# Altium project SensorBoard.PrjPcb
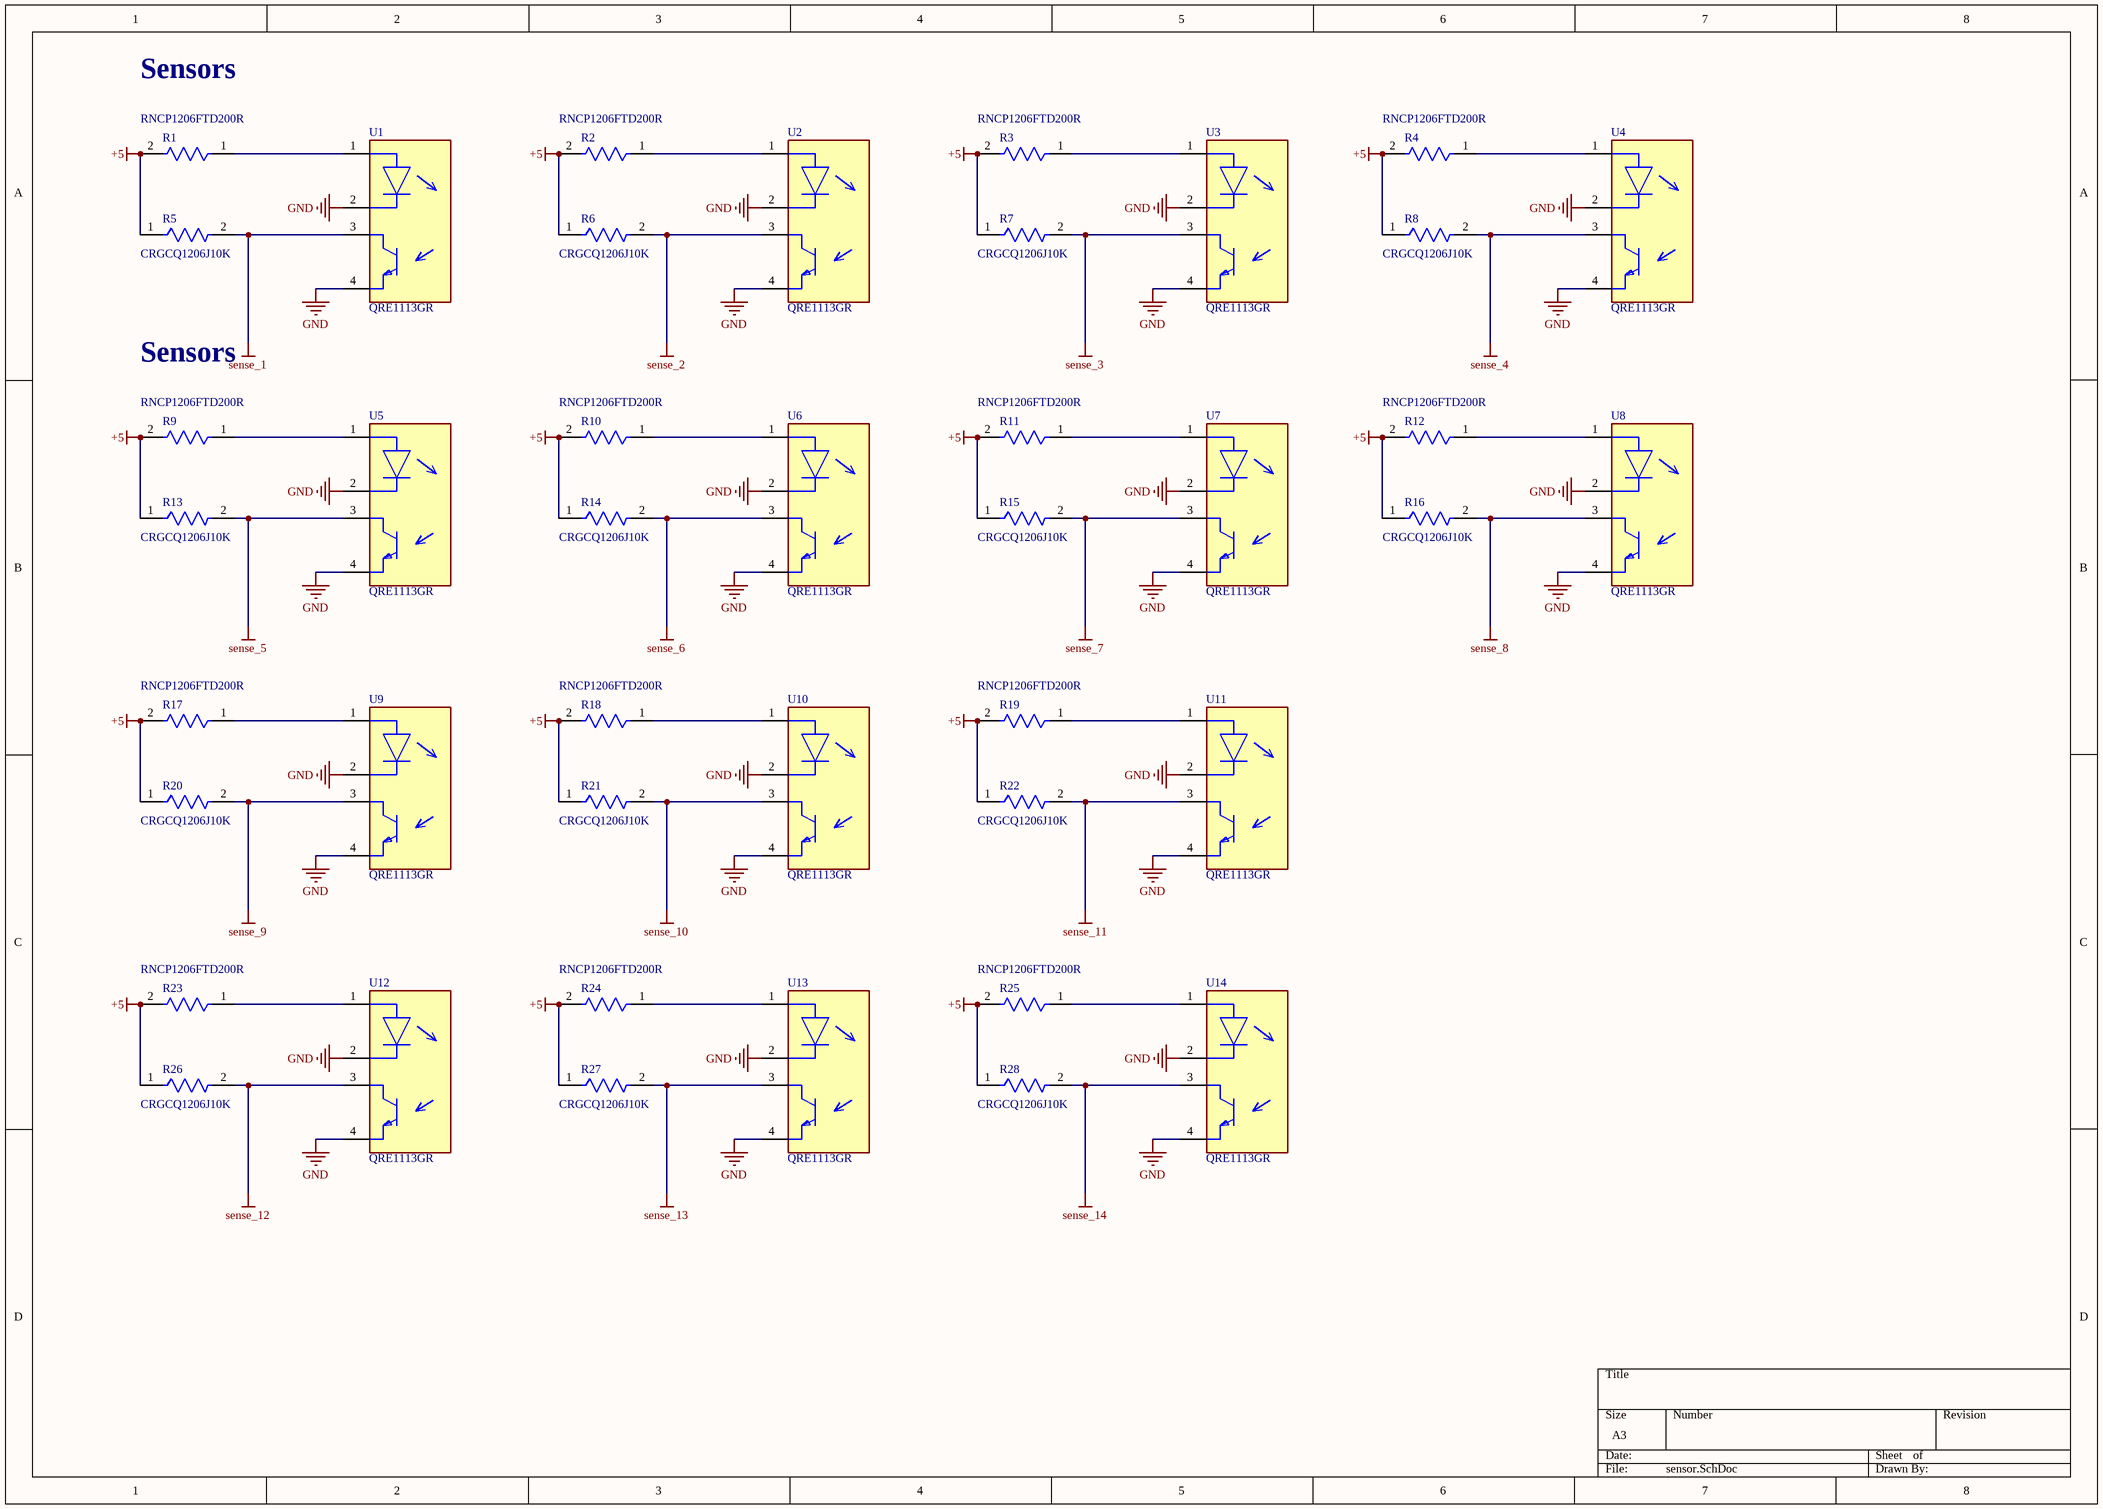
[diagram p0: sensor.SchDoc]
2 sheets, 47 parts. Net scope: global (net labels, ports and power ports of the same name join across sheets).
Board file: Sensor_board.PcbDoc
Sheets:
  sensor.SchDoc
  board.SchDoc

## Sheet sensor.SchDoc
size A3; SheetNumber: 1; SheetTotal: 2

### Parts
R1  RNCP1206FTD200R  [FP-RNCP1206-IPC_B]
R2  RNCP1206FTD200R  [FP-RNCP1206-IPC_B]
R3  RNCP1206FTD200R  [FP-RNCP1206-IPC_B]
R4  RNCP1206FTD200R  [FP-RNCP1206-IPC_B]
R5  CRGCQ1206J10K  [FP-CRGCQ1206-IPC_C]
R6  CRGCQ1206J10K  [FP-CRGCQ1206-IPC_C]
R7  CRGCQ1206J10K  [FP-CRGCQ1206-IPC_C]
R8  CRGCQ1206J10K  [FP-CRGCQ1206-IPC_C]
R9  RNCP1206FTD200R  [FP-RNCP1206-IPC_B]
R10  RNCP1206FTD200R  [FP-RNCP1206-IPC_B]
R11  RNCP1206FTD200R  [FP-RNCP1206-IPC_B]
R12  RNCP1206FTD200R  [FP-RNCP1206-IPC_B]
R13  CRGCQ1206J10K  [FP-CRGCQ1206-IPC_C]
R14  CRGCQ1206J10K  [FP-CRGCQ1206-IPC_C]
R15  CRGCQ1206J10K  [FP-CRGCQ1206-IPC_C]
R16  CRGCQ1206J10K  [FP-CRGCQ1206-IPC_C]
R17  RNCP1206FTD200R  [FP-RNCP1206-IPC_B]
R18  RNCP1206FTD200R  [FP-RNCP1206-IPC_B]
R19  RNCP1206FTD200R  [FP-RNCP1206-IPC_B]
R20  CRGCQ1206J10K  [FP-CRGCQ1206-IPC_C]
R21  CRGCQ1206J10K  [FP-CRGCQ1206-IPC_C]
R22  CRGCQ1206J10K  [FP-CRGCQ1206-IPC_C]
R23  RNCP1206FTD200R  [FP-RNCP1206-IPC_B]
R24  RNCP1206FTD200R  [FP-RNCP1206-IPC_B]
R25  RNCP1206FTD200R  [FP-RNCP1206-IPC_B]
R26  CRGCQ1206J10K  [FP-CRGCQ1206-IPC_C]
R27  CRGCQ1206J10K  [FP-CRGCQ1206-IPC_C]
R28  CRGCQ1206J10K  [FP-CRGCQ1206-IPC_C]
U1  QRE1113GR  [FP-100CY-MFG]
U2  QRE1113GR  [FP-100CY-MFG]
U3  QRE1113GR  [FP-100CY-MFG]
U4  QRE1113GR  [FP-100CY-MFG]
U5  QRE1113GR  [FP-100CY-MFG]
U6  QRE1113GR  [FP-100CY-MFG]
U7  QRE1113GR  [FP-100CY-MFG]
U8  QRE1113GR  [FP-100CY-MFG]
U9  QRE1113GR  [FP-100CY-MFG]
U10  QRE1113GR  [FP-100CY-MFG]
U11  QRE1113GR  [FP-100CY-MFG]
U12  QRE1113GR  [FP-100CY-MFG]
U13  QRE1113GR  [FP-100CY-MFG]
U14  QRE1113GR  [FP-100CY-MFG]

### Nets
+5: R1.2 R2.2 R3.2 R4.2 R5.1 R6.1 R7.1 R8.1 R9.2 R10.2 R11.2 R12.2 R13.1 R14.1 R15.1 R16.1 R17.2 R18.2 R19.2 R20.1 R21.1 R22.1 R23.2 R24.2 R25.2 R26.1 R27.1 R28.1
GND: U1.2(C) U1.4(E) U2.2(C) U2.4(E) U3.2(C) U3.4(E) U4.2(C) U4.4(E) U5.2(C) U5.4(E) U6.2(C) U6.4(E) U7.2(C) U7.4(E) U8.2(C) U8.4(E) U9.2(C) U9.4(E) U10.2(C) U10.4(E) U11.2(C) U11.4(E) U12.2(C) U12.4(E) U13.2(C) U13.4(E) U14.2(C) U14.4(E)
sense_1: R5.2 U1.3(C)
sense_2: R6.2 U2.3(C)
sense_3: R7.2 U3.3(C)
sense_4: R8.2 U4.3(C)
sense_5: R13.2 U5.3(C)
sense_6: R14.2 U6.3(C)
sense_7: R15.2 U7.3(C)
sense_8: R16.2 U8.3(C)
sense_9: R20.2 U9.3(C)
sense_10: R21.2 U10.3(C)
sense_11: R22.2 U11.3(C)
sense_12: R26.2 U12.3(C)
sense_13: R27.2 U13.3(C)
sense_14: R28.2 U14.3(C)
NetR1_1: R1.1 U1.1(A)
NetR2_1: R2.1 U2.1(A)
NetR3_1: R3.1 U3.1(A)
NetR4_1: R4.1 U4.1(A)
NetR9_1: R9.1 U5.1(A)
NetR10_1: R10.1 U6.1(A)
NetR11_1: R11.1 U7.1(A)
NetR12_1: R12.1 U8.1(A)
NetR17_1: R17.1 U9.1(A)
NetR18_1: R18.1 U10.1(A)
NetR19_1: R19.1 U11.1(A)
NetR23_1: R23.1 U12.1(A)
NetR24_1: R24.1 U13.1(A)
NetR25_1: R25.1 U14.1(A)

### Notes on the sheet
- Sensors

### Library data of the parts
R1-R4 R9-R12 R17-R19 R23-R25 = CMP-26527-001516-1: 200Ω ±1% 0.5W 1206 High Power Anti-Sulfur Thin Film Chip Resistor; Temperature Coefficient: 100ppm/°C; Resistance: 200R; Max Power Dissipation: 500mW; Series: RNCP; Max Operating Temperature: 155°C; Min Operating Temperature: -55°C; Mount: Surface Mount; RoHS Compliant: Yes; Tolerance: 1%; Height: 0.024inch; Resistor Type: Thin Film; Packaging: Tape and Reel; Case Code (Imperial): 1206; Case/Package: 1206; Lead Free: Lead Free; Width: 0.059inch; Number of Terminations: 2; Case Code (Metric): 3216; Length: 0.122inch; Features: Moisture Resistant
R5-R8 R13-R16 R20-R22 R26-R28 = CMP-03211-002305-1: CRGCQ1206 10KΩ 0.25W 5% ±100ppm/°C 200V; Manufacturer: TE Connectivity; Automotive Grade: Grade 914; Tolerance: 0.05; Package: CRGCQ1206; Composition: Thick Film; Lead Free: Yes; Device Class L1: Passive Components; RoHS: TRUE; Temperature: -55°C to +155°C; Series: CRGCQ; Temperature Range Low: -55°C; Ipc Land Pattern Name: RESC310155X55; Value: 10KΩ; Resistance: 10KΩ; Manufacturer Part Number: CRGCQ1206J10K; Voltage Rating: 200V; Temperature Range High: +155°C; Temperature Coefficient: ±100ppm/°C; Device Class L3: Chip SMD Resistors; ComponentLink2Description: Datasheet; ComponentLink2URL: https://www.te.com/commerce/DocumentDelivery/DDEController?Action=showdoc&DocId=Data+Sheet%7F1773204-3%7F1%7Fpdf%7FEnglish%7FENG_DS_1773204-3_1.pdf%7F4-2176347-923; Device Class L2: Resistors; Ambient Temperature Range High: +70°C; Automotive: Yes; Octopart: https://octopart.com/crgcq1206j10k-te+connectivity-91018305; Category: Res; Height: 0.65mm; Power Rating: 0.25W
U1-U14 = CMP-2000-06919-2: SENSOR OPTO TRANS REFL SMD PHOTO; Wavelength: 940nm; Fall Time: 20us; Forward Current: 50mA; Max Power Dissipation: 75mW; Operating Supply Voltage: 1.7V; Reverse Voltage (DC): 5V; Max Breakdown Voltage: 30V; Forward Voltage: 1.2V; Output Type: Phototransistor; Number of Elements: 1; Sensing Distance: 0.197inch; Max Collector Current: 20mA; Contact Plating: Tin; Packaging: Tape and Reel; Rise Time: 20us; Response Time: 20us; Case/Package: SMD/SMT; REACH SVHC: No SVHC; Lead Free: Lead Free; Width: 2.9mm; Package Quantity: 1000; Mount: Surface Mount; Input Current: 50mA; Max Operating Temperature: 85°C; Weight: 0.078g; Power Dissipation: 75mW; Reverse Breakdown Voltage: 5V; Collector Emitter Voltage (VCEO): 30V; Collector Emitter Breakdown Voltage: 30V; Number of Pins: 4; Min Operating Temperature: -40°C; Radiation Hardening: No; Height: 1.7mm; Number of Channels: 1; Length: 3.6mm

## Sheet board.SchDoc
size A4; SheetNumber: 2; SheetTotal: 2
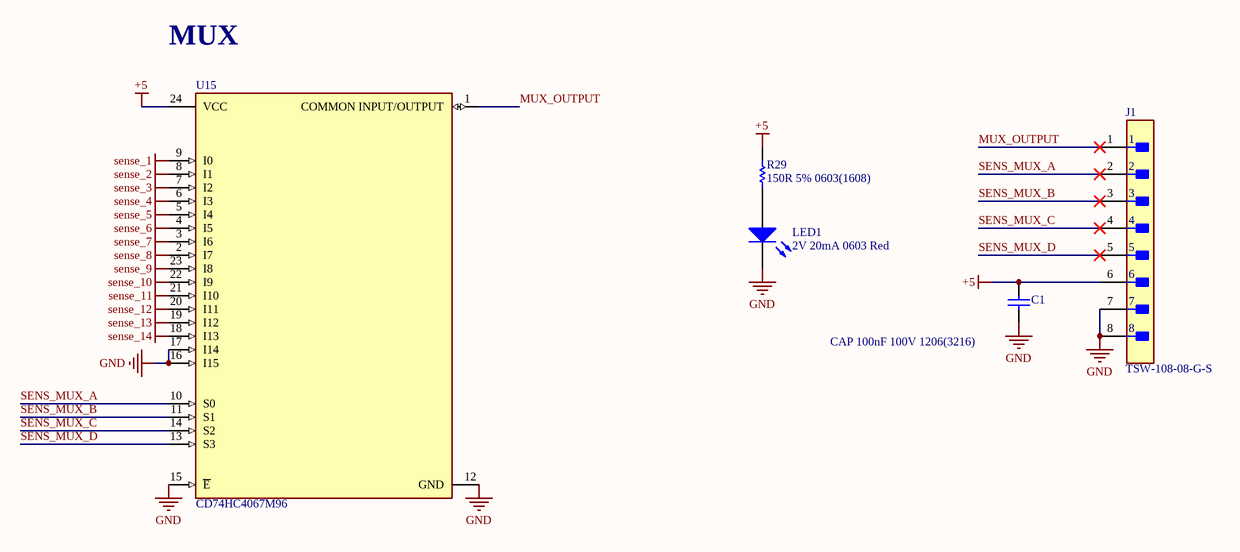
[diagram p1: board.SchDoc]

### Parts
C1  CAP 100nF 100V 1206(3216)  [CAPC1206(3216)150_N]
J1  TSW-108-08-G-S  [FP-TSW-108-08-G-S-MFG]
LED1  2V 20mA 0603 Red  [0603_A]
R29  150R 5% 0603(1608)  [RESC0603(1608)_L]
U15  CD74HC4067M96  [FP-DW0024A-MFG]

### Nets
+5: C1.1 J1.6 R29.2 U15.24(VCC)
GND: C1.2 J1.7 J1.8 LED1.1(K) U15.12(GND) U15.15(~{E}) U15.16(I15) U15.17(I14)
sense_1: U15.9(I0)
sense_2: U15.8(I1)
sense_3: U15.7(I2)
sense_4: U15.6(I3)
sense_5: U15.5(I4)
sense_6: U15.4(I5)
sense_7: U15.3(I6)
sense_8: U15.2(I7)
sense_9: U15.23(I8)
sense_10: U15.22(I9)
sense_11: U15.21(I10)
sense_12: U15.20(I11)
sense_13: U15.19(I12)
sense_14: U15.18(I13)
MUX_OUTPUT: J1.1 U15.1(COMMON_INPUT/OUTPUT)
SENS_MUX_A: J1.2 U15.10(S0)
SENS_MUX_B: J1.3 U15.11(S1)
SENS_MUX_C: J1.4 U15.14(S2)
SENS_MUX_D: J1.5 U15.13(S3)
NetLED1_2: LED1.2(A) R29.1

### Notes on the sheet
- MUX

### Library data of the parts
C1 = CMP-1037-04212-1: CAP 100nF 100V ±10% 1206 (3216 Metric) Thickness 1.45mm SMD; Case-EIA: 1206; Case-Metric: 3216; Tolerance: Â±10%; Value: 100nF; Technology: SMT; Max Thickness: 1.45 mm; Rated Voltage: 100 V
J1 = CMP-02766-000001-1: CONN HEADER VERT 8POS 2.54MM; Manufacturer: Samtec; Number Of Contacts: 8; Conn Orientation: Straight; Conn Gender: Male; Device Class L1: Connectors; ComponentLink2Description: Datasheet; Digikey Description: CONN HEADER VERT 8POS 2.54MM; ComponentLink2URL: http://suddendocs.samtec.com/catalog_english/tsw_th.pdf; Temperature: -55°C to +125°C; RoHS: TRUE; Mouser Description: TSW - Samtec 2.54mm Pin Header 13.46mm Overall Pin Length 5.08mm Tail; Automotive: No; Temperature Range High: +125°C; Package: TSW-108-08-G-S; Device Class L3: unset; Manufacturer Part Number: TSW-108-08-G-S; Pitch: 2.54mm; Number Of Rows: 1; Lead Free: Yes; Height: 8.71mm; Contact Material: Gold,Nickel; Footprint Url: http://suddendocs.samtec.com/prints/tsw-xxx-xx-x-x-xx-xxx-footprint.pdf; Temperature Range Low: -55°C; Octopart: https://octopart.com/tsw-108-08-g-s-samtec-272653; Category: Conn; Device Class L2: Headers and Wire Housings
LED1 = CMP-1426-00001-1: SMD mono-color Chip LED, WL-SMCW, Red; Manufacturer: Wuerth Elektronik; PartNumber: 150060RS75000; Color: Red; PackageReference: 0603_A; ComponentLink2URL: http://katalog.we-online.com/led/datasheet/150060RS75000.pdf; ComponentLink1URL: http://www.we-online.com; ComponentLink1Description: Manufacturer URL; ComponentLink2Description: Datasheet
R29 = CMP-1012-00054-1: 150R 0.1W 5% 0603 (1608 Metric)  SMD; Case-EIA: 0603; Value: 150.00 Ohm; Case-Metric: 1608; Power: 0.1 W; Tolerance: 5 %; Technology: SMT
U15 = CMP-04901-000007-1: IC MUX/DEMUX 1X16 24SOIC; Manufacturer: Texas Instruments; Standoff Height: 0.1mm; Logic Function Desc: Non-Inverting; Max Supply Voltage: 6V; Number Of Inputs: 16; Quiescent Current: 8uA; Number Of Circuits: 1; Propagation Delay: 6ns; Max Junction Temp: +150°C; Min Supply Voltage: 2V; ComponentLink2Description: Datasheet; Octopart: https://octopart.com/cd74hc4067m96-texas+instruments-722802; Ambient Temperature Range High: +125°C; Ipc Land Pattern Name: SOIC127P1030X265-24; Height: 2.65mm; Mouser Description: Multiplexer Switch ICs Hi-Spd CMOS 16Ch Anl Mltplxr/Demltplxr; Temperature Range Low: -55°C; Package: DW0024A; Temperature Range High: +125°C; Lead Free: Yes; ComponentLink2URL: http://www.ti.com/lit/ds/symlink/cd74hc4067.pdf; Manufacturer Part Number: CD74HC4067M96; RoHS: TRUE; Automotive: No; Device Class L1: Integrated Circuits (ICs); Digikey Description: IC MUX/DEMUX 1X16 24SOIC; Device Class L2: Logic ICs; Temperature: -55°C to +125°C; Device Class L3: Multiplexers; Category: IC; Ambient Temperature Range Low: -55°C; Number Of Outputs: 1

## Nets that join several sheets
+5: sensor (28 pins), board (C1.1 J1.6 R29.2 U15.24)
GND: sensor (28 pins), board (8 pins)
sense_1: sensor (R5.2 U1.3), board (U15.9)
sense_2: sensor (R6.2 U2.3), board (U15.8)
sense_3: sensor (R7.2 U3.3), board (U15.7)
sense_4: sensor (R8.2 U4.3), board (U15.6)
sense_5: sensor (R13.2 U5.3), board (U15.5)
sense_6: sensor (R14.2 U6.3), board (U15.4)
sense_7: sensor (R15.2 U7.3), board (U15.3)
sense_8: sensor (R16.2 U8.3), board (U15.2)
sense_9: sensor (R20.2 U9.3), board (U15.23)
sense_10: sensor (R21.2 U10.3), board (U15.22)
sense_11: sensor (R22.2 U11.3), board (U15.21)
sense_12: sensor (R26.2 U12.3), board (U15.20)
sense_13: sensor (R27.2 U13.3), board (U15.19)
sense_14: sensor (R28.2 U14.3), board (U15.18)